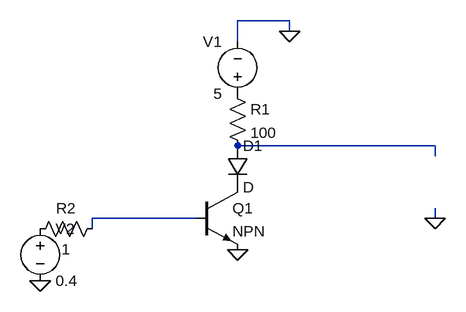
[diagram p0: schematic Draft1.asc]
Draft1.asc, the LTspice schematic file:
Version 4
SHEET 1 880 680
WIRE 416 -160 336 -160
WIRE 416 -144 416 -160
WIRE 336 -128 336 -160
WIRE 640 32 336 32
WIRE 640 48 640 32
WIRE 272 144 112 144
WIRE 640 144 640 128
WIRE 112 160 112 144
FLAG 640 144 0
FLAG 336 192 0
FLAG 416 -144 0
FLAG 32 240 0
SYMBOL npn 272 96 R0
SYMATTR InstName Q1
SYMBOL voltage 336 -32 R180
WINDOW 0 24 96 Left 2
WINDOW 3 24 16 Left 2
WINDOW 123 0 0 Left 0
WINDOW 39 0 0 Left 0
SYMATTR InstName V1
SYMATTR Value 5
SYMBOL diode 320 32 R0
SYMATTR InstName D1
SYMBOL res 320 -64 R0
SYMATTR InstName R1
SYMATTR Value 100
SYMBOL voltage 32 144 R0
WINDOW 123 0 0 Left 0
WINDOW 39 0 0 Left 0
SYMATTR InstName V2
SYMATTR Value 0.4
SYMBOL res 128 144 R90
WINDOW 0 0 56 VBottom 2
WINDOW 3 32 56 VTop 2
SYMATTR InstName R2
SYMATTR Value 1

The netlist it stands for:
* Draft1.asc
Q1 P001 N002 0 0 NPN
V1 P002 0 5
D1 N001 P001 D
R1 P002 N001 100
V2 P003 0 0.4
R2 N002 P003 1
.model D D
.lib standard.dio
.model NPN NPN
.model PNP PNP
.lib standard.bjt
.backanno
.end